# EAGLE schematic Adafruit CyberDeck HAT (EAGLE 9.6.2)
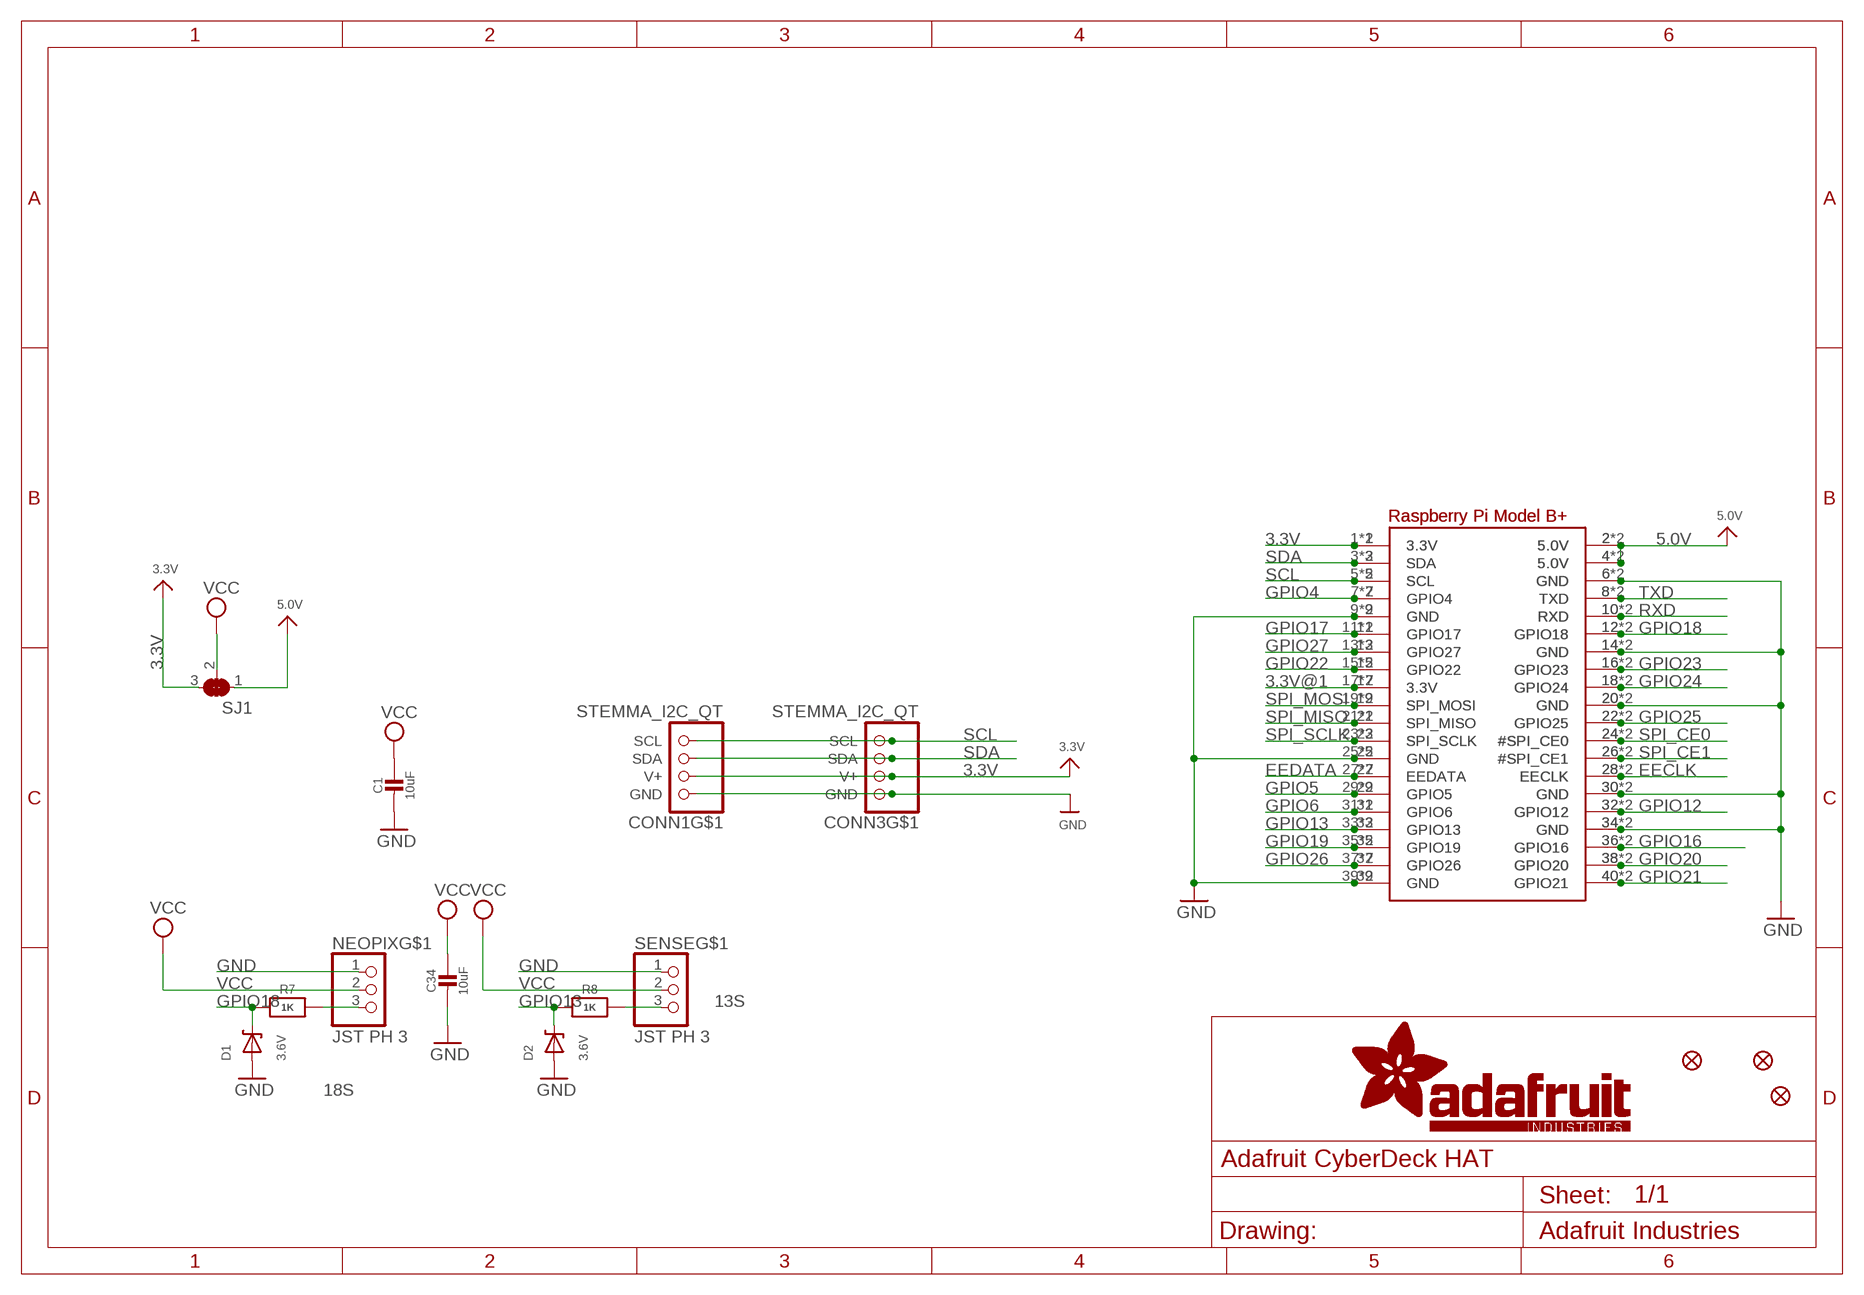
[diagram p0: schematic, sheet 1]

## Parts
C1  10uF  CAP_CERAMIC0805-NOOUTLINE  [0805-NO]
C34  10uF  CAP_CERAMIC0805-NOOUTLINE  [0805-NO]
CONN1  STEMMA_I2C_QT  [JST_SH4]
CONN3  STEMMA_I2C_QT  [JST_SH4]
D1  3.6V  DIODE-ZENERSOD323  [SOD-323]
D2  3.6V  DIODE-ZENERSOD323  [SOD-323]
FID1  FIDUCIAL_1MM  [FIDUCIAL_1MM]
FID2  FIDUCIAL_1MM  [FIDUCIAL_1MM]
FID3  FIDUCIAL_1MM  [FIDUCIAL_1MM]
NEOPIX  JST PH 3  CON_JST_PH_3PIN  [JSTPH3]
R7  1K  RESISTOR_0603_NOOUT  [0603-NO]
R8  1K  RESISTOR_0603_NOOUT  [0603-NO]
RPI1  RASPBERRYPI_BPLUS_IDC  [2X20]
RPI3  RASPBERRYPI_BPLUS_2X20_THMSMT_TOP  [RASPI_2X20_THMSMT_TOP]
SENSE  JST PH 3  CON_JST_PH_3PIN  [JSTPH3]
SJ1  SOLDERJUMPER_2WAY  [SOLDERJUMPER_2WAY_OPEN_NOPASTE]

## Nets
3.3V: CONN1.2(V+) CONN3.2(V+) RPI1.1(3.3V) RPI3.1(3.3V) RPI3.S1(3.3V) SJ1.3
3.3V@1: RPI1.17(3.3V) RPI3.17(3.3V) RPI3.S17(3.3V)
5.0V: RPI1.2(5.0V) RPI1.4(5.0V) RPI3.2(5.0V) RPI3.4(5.0V) RPI3.S2(5.0V) RPI3.S4(5.0V) SJ1.1
13S: R8.1 SENSE.3
18S: NEOPIX.3 R7.1
EECLK: RPI1.28(EECLK) RPI3.28(EECLK) RPI3.S28(EECLK)
EEDATA: RPI1.27(EEDATA) RPI3.27(EEDATA) RPI3.S27(EEDATA)
GND: C1.2 C34.2 CONN1.1(GND) CONN3.1(GND) D1.A D2.A NEOPIX.1 RPI1.6(GND) RPI1.9(GND) RPI1.14(GND) RPI1.20(GND) RPI1.25(GND) RPI1.30(GND) RPI1.34(GND) RPI1.39(GND) RPI3.6(GND) RPI3.9(GND) RPI3.14(GND) RPI3.20(GND) RPI3.25(GND) RPI3.30(GND) RPI3.34(GND) RPI3.39(GND) RPI3.S6(GND) RPI3.S9(GND) RPI3.S14(GND) RPI3.S20(GND) RPI3.S25(GND) RPI3.S30(GND) RPI3.S34(GND) RPI3.S39(GND) SENSE.1
GPIO4: RPI1.7(GPIO4) RPI3.7(GPIO4) RPI3.S7(GPIO4)
GPIO5: RPI1.29(GPIO5) RPI3.29(GPIO5) RPI3.S29(GPIO5)
GPIO6: RPI1.31(GPIO6) RPI3.31(GPIO6) RPI3.S31(GPIO6)
GPIO12: RPI1.32(GPIO12) RPI3.32(GPIO12) RPI3.S32(GPIO12)
GPIO13: D2.C R8.2 RPI1.33(GPIO13) RPI3.33(GPIO13) RPI3.S33(GPIO13)
GPIO16: RPI1.36(GPIO16) RPI3.36(GPIO16) RPI3.S36(GPIO16)
GPIO17: RPI1.11(GPIO17) RPI3.11(GPIO17) RPI3.S11(GPIO17)
GPIO18: D1.C R7.2 RPI1.12(GPIO18) RPI3.12(GPIO18) RPI3.S12(GPIO18)
GPIO19: RPI1.35(GPIO19) RPI3.35(GPIO19) RPI3.S35(GPIO19)
GPIO20: RPI1.38(GPIO20) RPI3.38(GPIO20) RPI3.S38(GPIO20)
GPIO21: RPI1.40(GPIO21) RPI3.40(GPIO21) RPI3.S40(GPIO21)
GPIO22: RPI1.15(GPIO22) RPI3.15(GPIO22) RPI3.S15(GPIO22)
GPIO23: RPI1.16(GPIO23) RPI3.16(GPIO23) RPI3.S16(GPIO23)
GPIO24: RPI1.18(GPIO24) RPI3.18(GPIO24) RPI3.S18(GPIO24)
GPIO25: RPI1.22(GPIO25) RPI3.22(GPIO25) RPI3.S22(GPIO25)
GPIO26: RPI1.37(GPIO26) RPI3.37(GPIO26) RPI3.S37(GPIO26)
GPIO27: RPI1.13(GPIO27) RPI3.13(GPIO27) RPI3.S13(GPIO27)
RXD: RPI1.10(RXD) RPI3.10(RXD) RPI3.S10(RXD)
SCL: CONN1.4(SCL) CONN3.4(SCL) RPI1.5(SCL) RPI3.5(SCL) RPI3.S5(SCL)
SDA: CONN1.3(SDA) CONN3.3(SDA) RPI1.3(SDA) RPI3.3(SDA) RPI3.S3(SDA)
SPI_CE0: RPI1.24(#SPI_CE0) RPI3.24(#SPI_CE0) RPI3.S24(#SPI_CE0)
SPI_CE1: RPI1.26(#SPI_CE1) RPI3.26(#SPI_CE1) RPI3.S26(#SPI_CE1)
SPI_MISO: RPI1.21(SPI_MISO) RPI3.21(SPI_MISO) RPI3.S21(SPI_MISO)
SPI_MOSI: RPI1.19(SPI_MOSI) RPI3.19(SPI_MOSI) RPI3.S19(SPI_MOSI)
SPI_SCLK: RPI1.23(SPI_SCLK) RPI3.23(SPI_SCLK) RPI3.S23(SPI_SCLK)
TXD: RPI1.8(TXD) RPI3.8(TXD) RPI3.S8(TXD)
VCC [power]: C1.1 C34.1 NEOPIX.2 SENSE.2 SJ1.2
Unconnected: CONN1.MT1(MT) CONN1.MT2(MT) CONN3.MT1(MT) CONN3.MT2(MT) NEOPIX.NC1(MT) NEOPIX.NC2(MT) SENSE.NC1(MT) SENSE.NC2(MT)

## Library data of the parts
C1 C34 = microbuilder:CAP_CERAMIC: Ceramic Capacitors For new designs, use the packages preceded by an '_' character since they are more reliable: The following footprints should be used on most boards: _0402 - Standard footprint for regular board layouts _0603 - Standard footprint for regular board layouts _0805 - Standard footprint for regular board layouts _1206 - Standard footprint for regular board layouts For extremely tight-pitch boards where space is at a premium, the following 'micro-pitch' footprints can be used (smaller pads, no silkscreen outline, etc.): _0402MP - Micro-pitch footprint for very dense/compact boards _0603MP - Micro-pitch footprint for very dense/compact boards _0805MP - Micro-pitch footprint for very dense/compact boards _1206MP - Micro-pitch footprint for very dense/compact boards
CONN1 CONN3 = microbuilder:STEMMA_I2C
D1 D2 = microbuilder:DIODE-ZENER: Zener Diode SMA: 30V 1W Zener Diode, 1.2Vf - Digikey: SMAZ30-FDICT-ND
FID1-FID3 = microbuilder:FIDUCIAL: Fiducial Alignment Points Various fiducial points for machine vision alignment.; BOM: EXCLUDE
NEOPIX SENSE = microbuilder:CON_JST_PH_3PIN
R7 R8 = microbuilder:RESISTOR: Resistors For new designs, use the packages preceded by an '_' character since they are more reliable: The following footprints should be used on most boards: _0402 - Standard footprint for regular board layouts _0603 - Standard footprint for regular board layouts _0805 - Standard footprint for regular board layouts _1206 - Standard footprint for regular board layouts For extremely tight-pitch boards where space is at a premium, the following 'micro-pitch' footprints can be used (smaller pads, no silkscreen outline, etc.): _0402MP - Micro-pitch footprint for very dense/compact boards _0603MP - Micro-pitch footprint for very dense/compact boards _0805MP - Micro-pitch footprint for very dense/compact boards _1206MP - Micro-pitch footprint for very dense/compact boards
RPI1 RPI3 = adafruit_sbc:RASPBERRYPI_BPLUS
SJ1 = microbuilder:SOLDERJUMPER_2WAY: 2-Way Solder Jumper

## Net classes
1 power: width 0.305 mm